# EAGLE design Ethernet ENC28 (EAGLE 5.04)
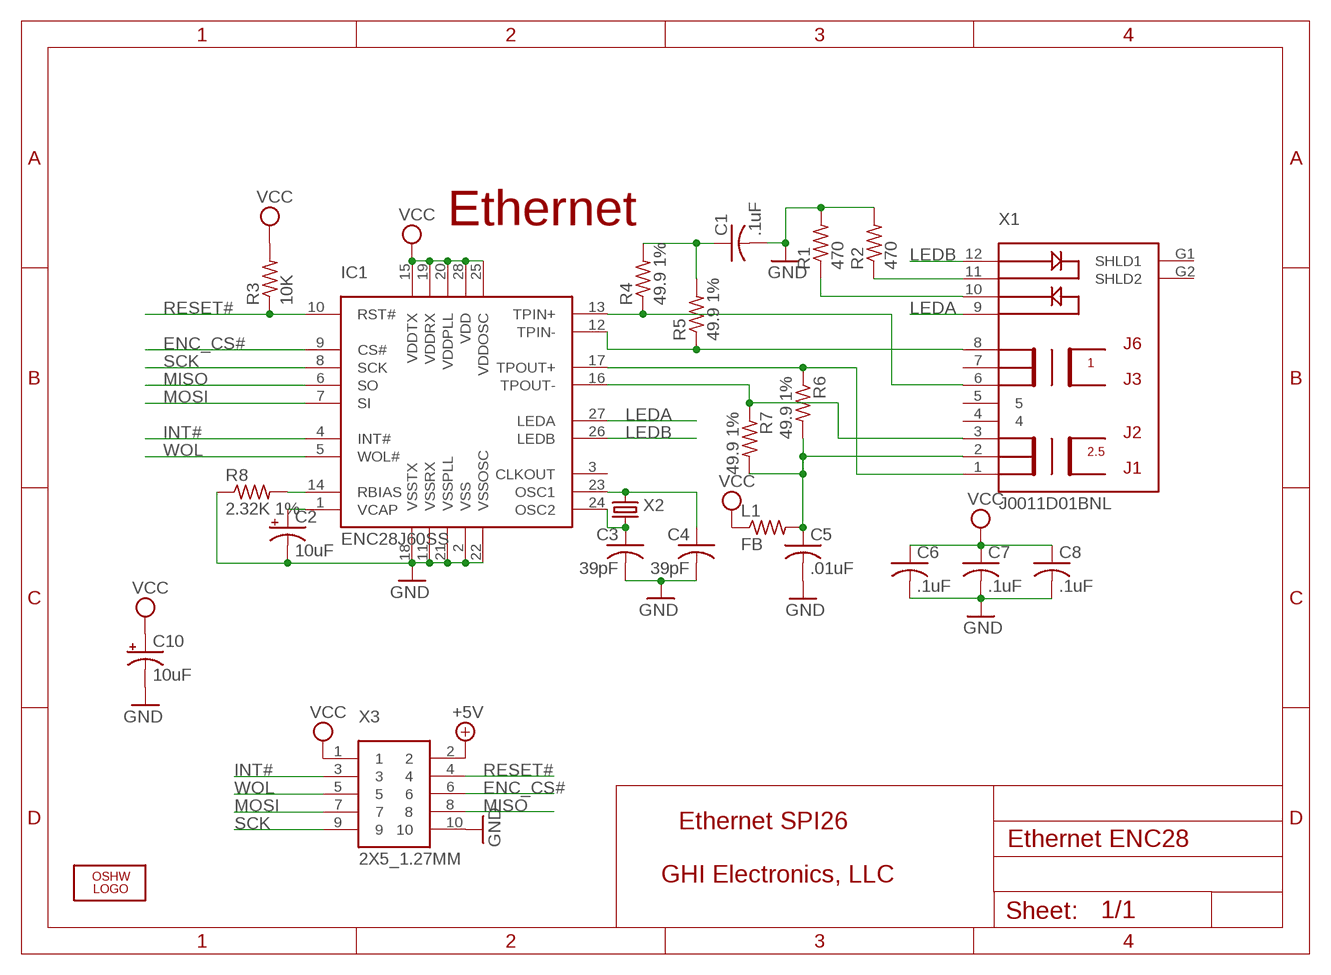
[diagram p0: schematic, sheet 1]

## Parts
C1  .1uF  C-USC0603K  [C0603K]
C2  10uF  CPOL-USCT3528  [CT3528]
C3  39pF  C-USC0603K  [C0603K]
C4  39pF  C-USC0603K  [C0603K]
C5  .01uF  C-USC0603K  [C0603K]
C6  .1uF  C-USC0603K  [C0603K]
C7  .1uF  C-USC0603K  [C0603K]
C8  .1uF  C-USC0603K  [C0603K]
C10  10uF  CPOL-USCT3528  [CT3528]
IC1  ENC28J60SS  [SSOP28]
L1  FB  R-US_R0603  [R0603]
LOGO  LOGO-OSHW-FILLX0200-NT  [OSHW_FILLX200_NOTEXT]
R1  470  R-US_R0603  [R0603]
R2  470  R-US_R0603  [R0603]
R3  10K  R-US_R0603  [R0603]
R4  49.9 1%  R-US_R0603  [R0603]
R5  49.9 1%  R-US_R0603  [R0603]
R6  49.9 1%  R-US_R0603  [R0603]
R7  49.9 1%  R-US_R0603  [R0603]
R8  2.32K 1%  R-US_R0603  [R0603]
X1  J0011D01BNL  LT1S023A  [LT1S023A]
X2  25Mhz  CRYTALHC49UP  [HC49UP]
X3  2X5_1.27MM  [2X5_1.27MM]

## Nets
+5V [power]: X3.2
ENC_CS#: IC1.9(CS#) X3.6
GND [power]: C1.2 C2.- C3.2 C4.2 C5.2 C6.2 C7.2 C8.2 C10.- IC1.2(VSS) IC1.11(VSSRX) IC1.18(VSSTX) IC1.21(VSSPLL) IC1.22(VSSOSC) R1.2 R2.2 R8.1 X3.10
INT#: IC1.4(INT#) X3.3
LEDA: IC1.27(LEDA) X1.9
LEDB: IC1.26(LEDB) X1.12
MISO: IC1.6(SO) X3.8
MOSI: IC1.7(SI) X3.7
N$1: IC1.12(TPIN-) R5.1 X1.8
N$2: C1.1 R4.2 R5.2
N$11: IC1.14(RBIAS) R8.2
N$12: C2.+ IC1.1(VCAP)
N$14: C3.1 IC1.24(OSC2) X2.1
N$16: C4.1 IC1.23(OSC1) X2.2
N$17: IC1.17(TPOUT+) R6.1 X1.1
N$19: IC1.13(TPIN+) R4.1 X1.6
N$22: IC1.16(TPOUT-) R7.1 X1.3
N$23: C5.1 L1.2 R6.2 R7.2 X1.2
N$24: R2.1 X1.11
N$25: R1.1 X1.10
RESET#: IC1.10(RST#) R3.1 X3.4
SCK: IC1.8(SCK) X3.9
VCC [power]: C6.1 C7.1 C8.1 C10.+ IC1.15(VDDTX) IC1.19(VDDRX) IC1.20(VDDPLL) IC1.25(VDDOSC) IC1.28(VDD) L1.1 R3.2 X3.1
WOL: IC1.5(WOL#) X3.5
Unconnected: IC1.3(CLKOUT) X1.4 X1.5 X1.7 X1.G1(SHLD1) X1.G2(SHLD2)

## Notes on the sheet
- Ethernet
- Ethernet SPI26
- GHI Electronics, LLC

## Library data of the parts
C1 C3-C8 = rcl:C-US: CAPACITOR, American symbol
C2 C10 = rcl:CPOL-US: POLARIZED CAPACITOR, American symbol
IC1 = GHI:ENC28J60
L1 R1-R8 = rcl:R-US_: RESISTOR, American symbol
LOGO = Logo:LOGO-OSHW-FILL
X1 = GHI:LT1S023A
X2 = crystal:CRYTAL: CRYSTAL
X3 = GHI:2X5_1.27MM

## Net classes
0 default: width 0.254 mm, drill 0.381 mm, clearance 0.203 mm

## Board
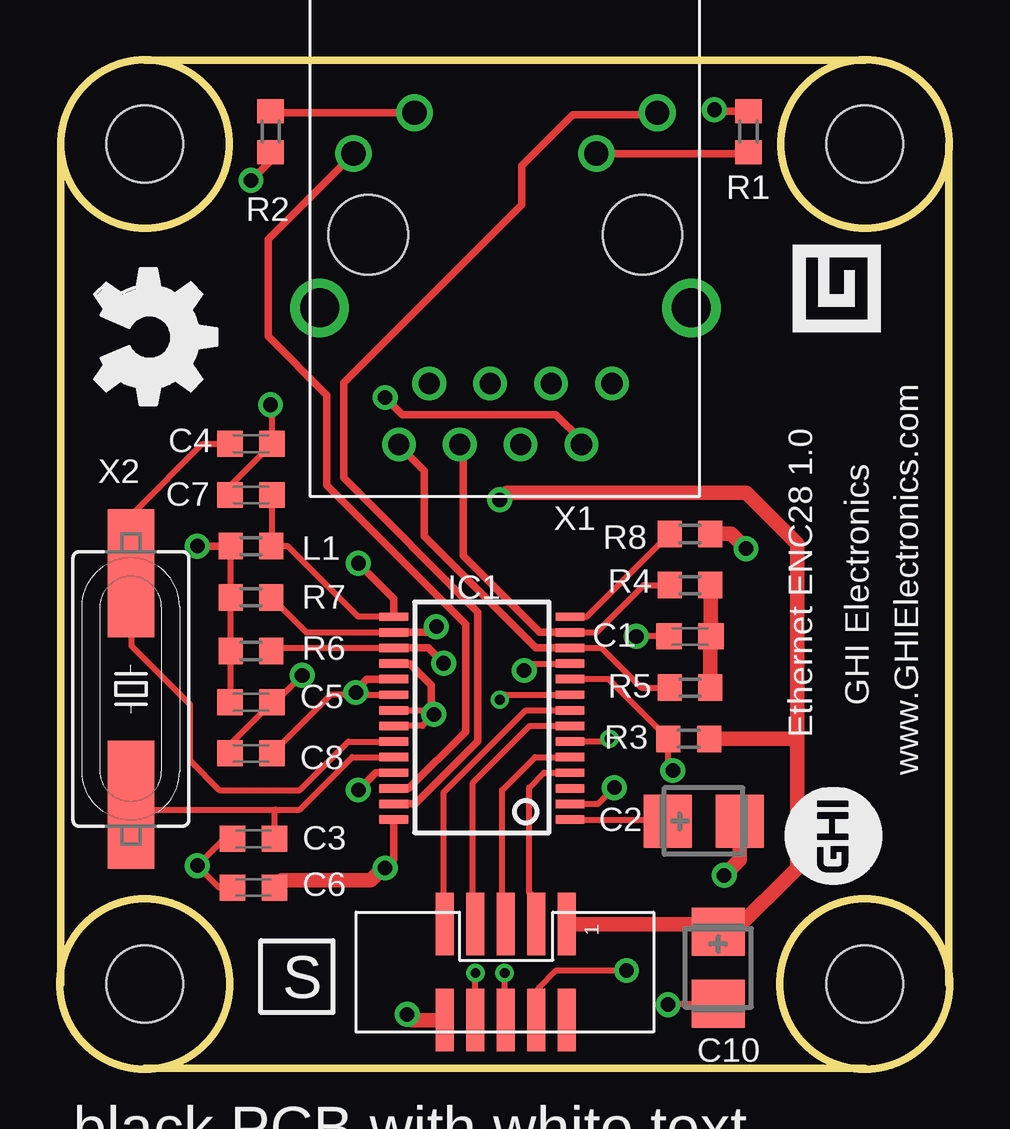
[diagram p1: board, top side]
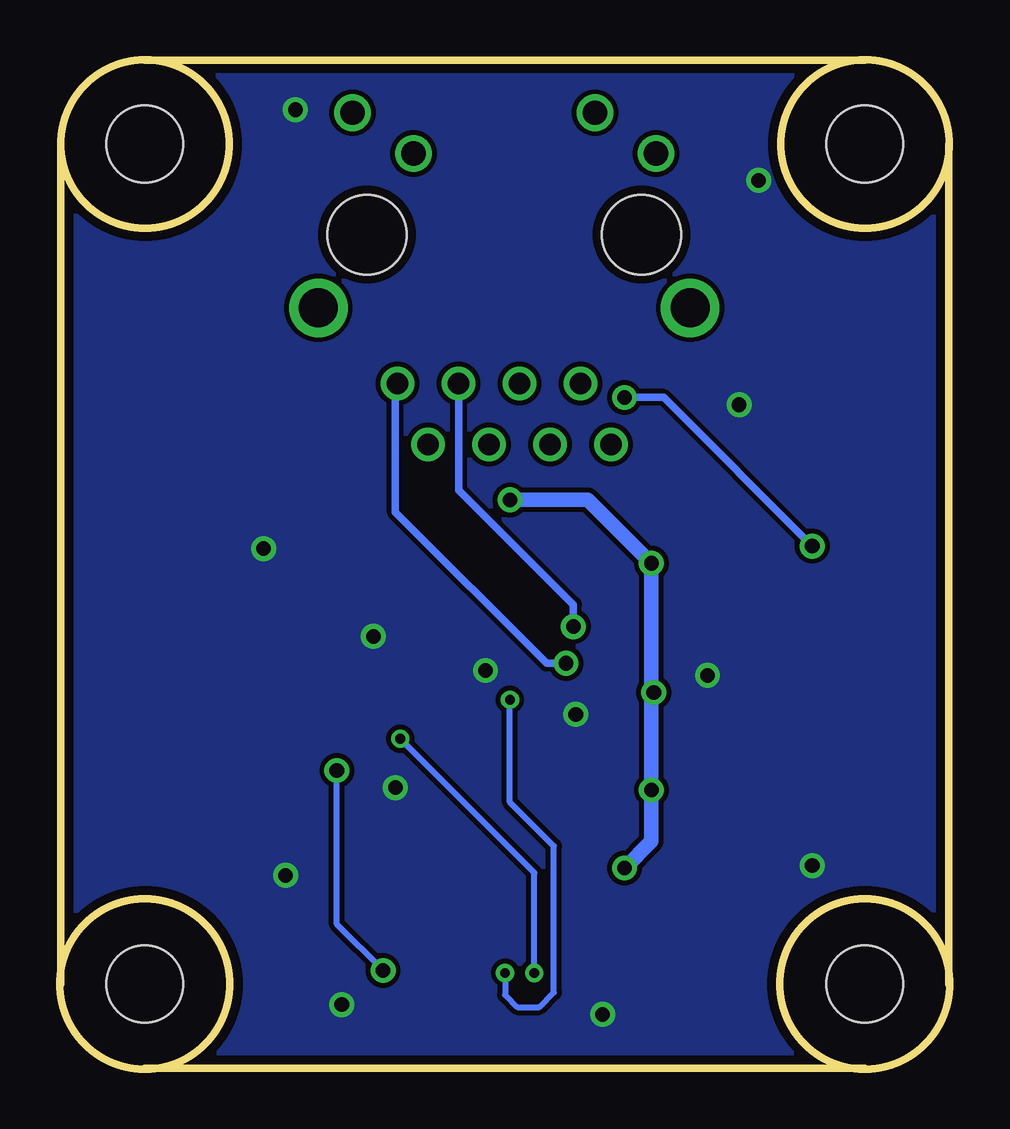
[diagram p2: board, bottom side, seen from below]

Size 37.07 x 42.04 mm. Coordinates in mm from the lower left corner, seen from the top.
Outline: 37.04,3.54 37.04,38.54
Outline: 0.04,38.54 0.04,3.54
Outline: 3.54,42.04 33.54,42.04
Outline: 33.54,0.04 3.54,0.04
Outline: circle at 3.54,38.54 radius 3.5
Outline: circle at 33.54,38.54 radius 3.5
Outline: circle at 33.54,3.54 radius 3.54
Outline: circle at 3.54,3.54 radius 3.54
Copper layers (1+16): Top 0.035mm / dielectric 1.5mm / Bottom 0.035mm
Design rules "default *": minimum track width 8mil, minimum drill 12mil, track to track 8mil, track to pad 8mil, pad to pad 8mil, via to via 8mil, smd to smd 8mil, copper to edge 15mil, drill to drill 8mil, minimum pad ring 10mil, minimum via ring 7mil, stop-mask expansion 4mil, vias tented up to drill 50mil, thermal gap 10mil
Holes 3.2 mm at 3.54,3.54 33.54,38.54 3.54,38.54 33.54,3.54

### Footprints (pad centres in the part's own frame; a part is rotated, then mirrored left to right if it is on the bottom)
C0603K = smd 1.05 x 1.08: 1 -0.875,0; 2 0.875,0
CT3528 = smd 2 x 2.2: + -1.5,0; - 1.5,0
SSOP28 = smd 0.35 x 1.2: 1 -4.255,-3.675; 2 -3.605,-3.675; 3 -2.955,-3.675; 4 -2.305,-3.675; 5 -1.655,-3.675; 6 -1.005,-3.675; 7 -0.355,-3.675; 8 0.295,-3.675; 9 0.945,-3.675; 10 1.595,-3.675; 11 2.245,-3.675; 12 2.895,-3.675; 13 3.545,-3.675; 14 4.195,-3.675; 15 4.195,3.675; 16 3.545,3.675; 17 2.895,3.675; 18 2.245,3.675; 19 1.595,3.675; 20 0.945,3.675; 21 0.295,3.675; 22 -0.355,3.675; 23 -1.005,3.675; 24 -1.655,3.675; 25 -2.305,3.675; 26 -2.955,3.675; 27 -3.605,3.675; 28 -4.255,3.675
R0603 = smd 1 x 1.1: 1 -0.85,0; 2 0.85,0
LT1S023A = drill 0.889 round: 1 4.47,-6.477; 2 3.2,-9.017; 3 1.93,-6.477; 4 0.66,-9.017; 5 -0.61,-6.477; 6 -1.88,-9.017; 7 -3.15,-6.477; 8 -4.42,-9.017 | drill 1.016 round: 9 6.35,4.801; 10 3.81,3.099; 11 -3.759,4.801; 12 -6.299,3.099 | drill 1.626 round: G1 -7.722,-3.327; G2 7.772,-3.327 | hole 3.302: -5.69,-0.279; 5.74,-0.279
HC49UP@1 = smd 5.334 x 1.93: 1 -4.826,0; 2 4.826,0
2X5_1.27MM = smd 2.6 x 0.74: 1 -2,2.58; 2 2,2.58; 3 -2,1.31; 4 2,1.31; 5 -2,0.04; 6 2,0.04; 7 -2,-1.23; 8 2,-1.23; 9 -2,-2.5; 10 2,-2.5

### Placement (x,y rotation side)
C1  26.25,18.02 180 top
C2  26.82,10.32 0 top
C3  8.06,9.59 180 top
C4  7.96,26.05 0 top
C5  7.96,15.28 0 top
C6  8.06,7.55 180 top
C7  7.96,23.91 180 top
C8  7.96,13.14 180 top
C10  27.43,4.2 270 top
IC1  17.58,14.64 90 top
L1  7.96,21.78 180 top
LOGO  1.44,33.33 270 top
R1  28.69,39.05 90 top
R2  8.77,39.05 270 top
R3  26.2,13.75 0 top
R4  26.25,20.15 0 top
R5  26.25,15.89 0 top
R6  7.96,17.41 180 top
R7  7.96,19.64 180 top
R8  26.25,22.29 180 top
X1  18.54,35.04 0 top
X2  25Mhz  [HC49UP@1]  2.95,15.83 90 top
X3  18.54,4.04 270 top

### Tracks (layer width: path | path; a pad name or v marks a point on that pad's centre or on a via)
ENC_CS#  (via drill 0.41)
  Top 0.254: IC1.9 18.54,15.59 v18.32,15.38 | v18.53,4 18.53,2.08 X3.6
  Bottom 0.254: v18.32,15.38 18.32,11.11 16.49,9.28 16.49,3.19 17.1,2.58 18.02,2.58 18.53,3.08 v18.53,4
GND  (via drill 0.61)
  Top 0.254: IC1.2 22.42,11.04 v23.1,11.72 | C10.- 25.36,2.7 v25.33,2.68 | IC1.22 15.1,14.29 v15.58,14.77 15.41,14.94 IC1.21 | IC1.11 19.53,16.89 v19.34,16.6 | C1.2 v24.01,18.02 | C8.2 7.09,13.53 C5.2 8.98,15.28 v10.09,16.39 | C3.2 6.84,9.59 v5.73,8.47 6.64,7.55 C6.2 | v8.77,27.67 8.84,27.61 C4.2 7.09,24.3 C7.2
  Top 0.305: IC1.18 14.58,16.89 15.48,15.99 15.48,14.87 v15.58,14.77 | R1.2 27.33,39.9 v27.26,39.96 | R2.2 8.77,37.83 v7.96,37.02
  Top 0.61: X3.10 14.7,2.04 v14.46,2.27 | C2.- 28.32,8.71 v27.67,8.06 | R8.1 27.98,22.29 v28.59,21.68
  pour Bottom: 36.92,-0.07 36.92,42.2 0.04,42.2 0.04,-0.07
INT#
  Top 0.254: IC1.4 20.16,12.34 19.54,11.72 19.54,7.35 19.85,7.05 X3.3
LEDA
  Top 0.305: IC1.27 14.8,11.04 17.41,13.65 17.41,19.03 11.82,24.62 11.82,28.59 19.24,36 19.24,37.63 21.37,39.76 24.81,39.76 X1.9
LEDB
  Top 0.305: IC1.26 14.53,11.69 16.9,14.06 16.9,18.53 11.11,24.32 11.11,28.08 8.67,30.52 8.67,34.57 X1.12
MISO  (via drill 0.41)
  Top 0.254: X3.8 v17.31,4 | IC1.6 22.78,13.64 v22.9,13.75
  Bottom 0.254: v17.31,4 17.31,8.16 v22.9,13.75
MOSI
  Top 0.254: IC1.7 19.57,14.29 17.21,11.92 17.21,6.14 X3.7
N$1
  Top 0.254: IC1.12 22.56,17.54 24.22,15.89 R5.1
  Top 0.305: IC1.12 19.82,17.54 15.17,22.18 15.17,24.93 14.26,25.84 14.16,25.98 X1.8
N$2
  Top 0.61: R5.2 27.1,17.99 C1.1 27.12,20.13 R4.2
N$11
  Top 0.254: IC1.14 21.95,18.84 R8.2
N$12
  Top 0.254: IC1.1 25.25,10.39 C2.+
N$14
  Top 0.254: IC1.24 12.18,12.99 9.99,10.81 8.98,10.81 | 8.98,10.81 3.15,10.81 X2.1 | C3.1 8.94,10.77 8.98,10.81
N$16
  Top 0.254: IC1.23 12.01,13.64 9.99,11.62 6.64,11.62 5.42,12.84 5.42,15.17 2.98,17.61 2.98,20.62 X2.2 3.08,20.78 3.08,23.2 5.93,26.05 C4.1
N$17  (via drill 0.61)
  Top 0.254: IC1.17 8.94,17.54 R6.1
  Top 0.305: IC1.17 15.35,17.54 v15.99,16.9
  Bottom 0.305: v15.99,16.9 16.8,16.9 23.1,23.2 23.1,28.47 X1.1
N$19
  Top 0.254: IC1.13 22.35,18.19 24.32,20.15 R4.1
  Top 0.305: IC1.13 19.98,18.19 16.8,21.37 16.8,25.87 X1.6
N$22  (via drill 0.61)
  Top 0.254: IC1.16 10.27,18.19 R7.1
  Top 0.305: IC1.16 15.34,18.19 v15.68,18.43
  Bottom 0.305: v15.68,18.43 15.68,19.34 20.46,24.11 X1.3
N$23  (via drill 0.61)
  Top 0.254: C5.1 7.09,17.38 R6.2 R7.2 L1.2
  Top 0.305: X1.2 21.74,26.19 20.66,27.26 14.26,27.26 v13.55,27.98 | L1.2 v5.73,21.78
  Bottom 0.305: v13.55,27.98 11.92,27.98 v5.73,21.78
N$24
  Top 0.305: X1.11 8.84,39.84 R2.1
N$25
  Top 0.305: X1.10 28.62,38.13 R1.1
RESET#  (via drill 0.61)
  Top 0.254: IC1.10 22.86,16.24 R3.1 25.35,12.62 v25.54,12.43 | v23.61,4.1 20.66,4.1 19.95,3.39 19.95,2.14 X3.4
  Bottom 0.254: v25.54,12.43 25.54,6.03 v23.61,4.1
SCK
  Top 0.254: IC1.8 19.41,14.94 15.99,11.52 15.99,6.08 X3.9
VCC  (via drill 0.61)
  Top 0.254: IC1.15 12.42,18.84 9.48,21.78 L1.1 8.84,21.8 C7.1 | IC1.20 12.13,15.59 11.28,15.59 C8.1
  Top 0.305: IC1.28 13.9,8.72 v13.55,8.37 | IC1.15 13.9,19.59 v12.43,21.07 | IC1.25 13.15,12.34 v12.43,11.62 | IC1.19 12.78,16.24 12.13,15.59 12.24,15.59 v12.33,15.68
  Top 0.61: v13.55,8.37 13.45,8.37 12.94,7.86 9.24,7.86 C6.1 | 30.72,13.75 30.72,8.37 28.06,5.7 C10.+ 27.1,6.04 X3.1 | 30.72,13.75 30.72,21.88 28.59,24.01 18.63,24.01 v18.32,23.71 | 30.72,13.75 R3.2
  Bottom 0.305: 12.43,15.78 v12.33,15.68 12.43,15.58
  Bottom 0.61: v13.55,8.37 12.43,9.48 v12.43,11.62 12.43,15.58 | 12.43,15.78 v12.43,21.07 15.07,23.71 v18.32,23.71
WOL
  Top 0.254: IC1.5 19.8,12.99 18.43,11.62 18.43,6.19 X3.5

### Text on the board
tPlace: GHI Electronics | Ethernet ENC28 1.0 | www.GHIElectronics.com | S | black PCB with white text | corner holes are nonplated | do not add manufacturing codes